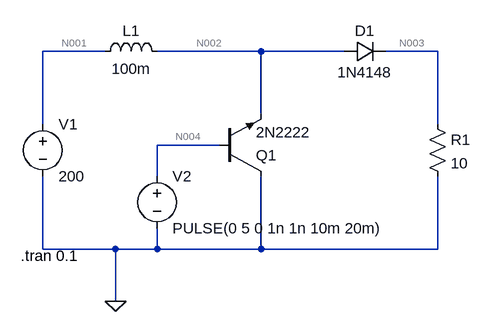
[diagram p0: schematic StepUp-Chopper-RL.asc]
StepUp-Chopper-RL.asc, the LTspice schematic file:
Version 4
SHEET 1 1320 680
WIRE 160 0 64 0
WIRE 400 0 240 0
WIRE 528 0 400 0
WIRE 672 0 592 0
WIRE 400 96 400 0
WIRE 64 112 64 0
WIRE 672 112 672 0
WIRE 336 144 240 144
WIRE 240 192 240 144
WIRE 64 304 64 192
WIRE 176 304 64 304
WIRE 240 304 240 272
WIRE 240 304 176 304
WIRE 400 304 400 192
WIRE 400 304 240 304
WIRE 672 304 672 192
WIRE 672 304 400 304
WIRE 176 384 176 304
FLAG 176 384 0
SYMBOL voltage 64 96 R0
WINDOW 123 0 0 Left 0
WINDOW 39 0 0 Left 0
SYMATTR InstName V1
SYMATTR Value 200
SYMBOL ind 144 16 R270
WINDOW 0 32 56 VTop 2
WINDOW 3 5 56 VBottom 2
SYMATTR InstName L1
SYMATTR Value 100m
SYMBOL diode 528 16 R270
WINDOW 0 32 32 VTop 2
WINDOW 3 0 32 VBottom 2
SYMATTR InstName D1
SYMATTR Value 1N4148
SYMBOL res 656 96 R0
SYMATTR InstName R1
SYMATTR Value 10
SYMBOL npn 336 192 M180
SYMATTR InstName Q1
SYMATTR Value 2N2222
SYMBOL voltage 240 176 R0
WINDOW 123 0 0 Left 0
WINDOW 39 0 0 Left 0
SYMATTR InstName V2
SYMATTR Value PULSE(0 5 0 1n 1n 10m 20m)
TEXT 30 314 Left 2 !.tran 0.1

The netlist it stands for:
* StepUp-Chopper-RL.asc
V1 N001 0 200
L1 N001 N002 100m
D1 N002 N003 1N4148
R1 N003 0 10
Q1 0 N004 N002 0 2N2222
V2 N004 0 PULSE(0 5 0 1n 1n 10m 20m)
.model D D
.lib standard.dio
.model NPN NPN
.model PNP PNP
.lib standard.bjt
.tran 0.1
.backanno
.end

* Results of the author's LTspice run, read from the files saved beside the schematic
* Operating Point, zero values left out:
*   V(n001) = 200 V
*   V(n002) = 200 V
*   V(n003) = 188.1 V
*   Ib(Q1) = -200 pA
*   Ie(Q1) = 199.9 pA
*   I(D1) = 18.81 A
*   I(L1) = 18.81 A
*   I(R1) = 18.81 A
*   I(V2) = 200 pA
*   I(V1) = -18.81 A
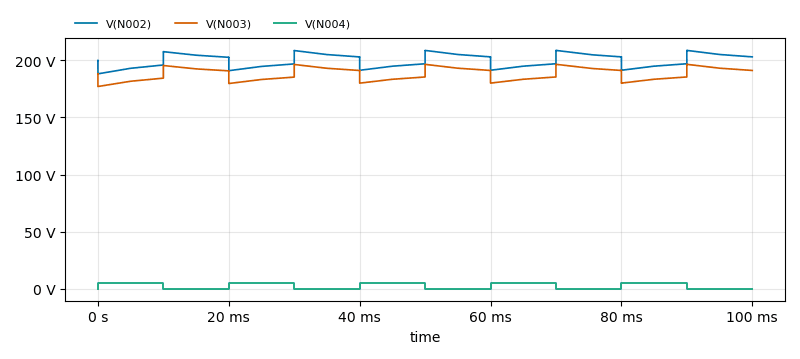
[diagram p1: Transient Analysis of StepUp-Chopper-RL.asc, plotted from the saved traces]
* Transient Analysis, 1 run:
*   V(N002): min 188.2 V, max 208.7 V, average 199.7 V, rms 199.8 V, last 203 V
*   V(N003): min 177.1 V, max 196.5 V, average 188 V, rms 188.1 V, last 191.1 V
*   V(N004): min 0 V, max 5 V, average 2.5 V, rms 3.536 V, last 0 V